# EAGLE design TargetBoard-ResistiveDivider1 (EAGLE 7.3.0)
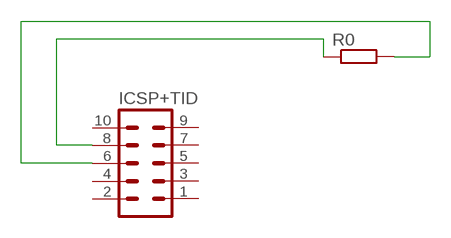
[diagram p0: schematic, sheet 1]

## Parts
ICSP+TID  MA05-2  [MA05-2]
R0  R-EU_R1206  [R1206]

## Nets
N$1: ICSP+TID.6 R0.2
N$2: ICSP+TID.8 R0.1
Unconnected: ICSP+TID.1 ICSP+TID.2 ICSP+TID.3 ICSP+TID.4 ICSP+TID.5 ICSP+TID.7 ICSP+TID.9 ICSP+TID.10

## Library data of the parts
ICSP+TID = con-lstb:MA05-2: PIN HEADER; OC_FARNELL: unknown; OC_NEWARK: unknown
R0 = resistor:R-EU_: RESISTOR, European symbol

## Board
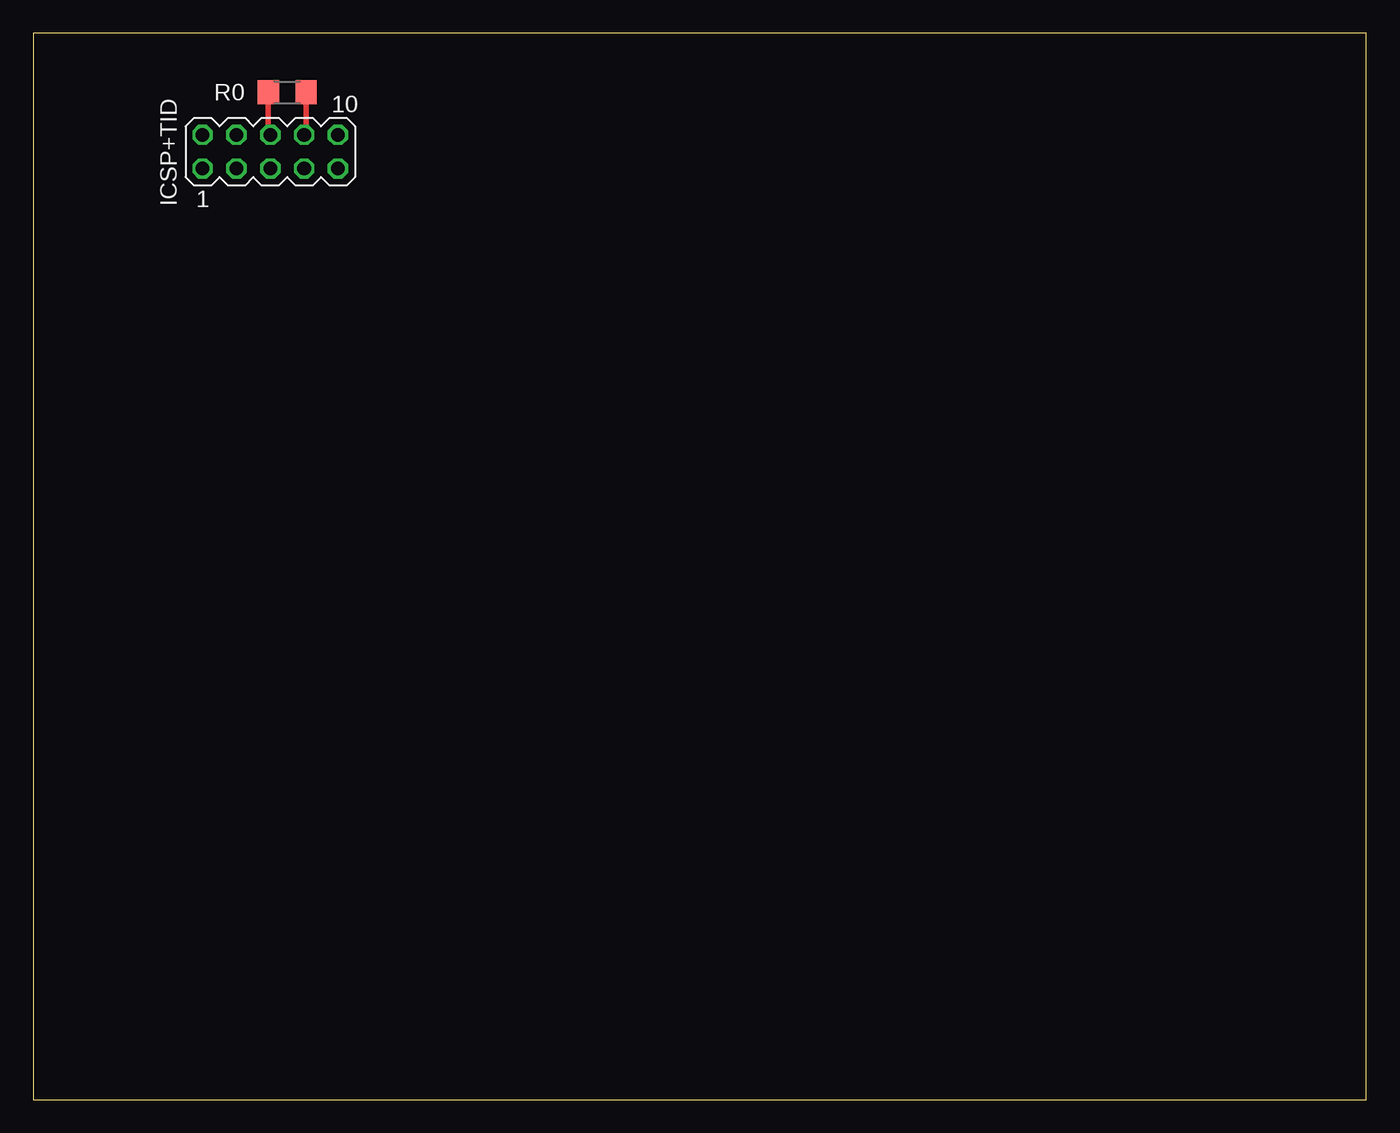
[diagram p1: board, top side]

Size 100 x 80 mm. Coordinates in mm from the lower left corner, seen from the top.
Outline: 0,0 100,0 100,80 0,80 0,0
Copper layers (1*16): Top 0.035mm / dielectric 1.5mm / Bottom 0.035mm
Design rules "default": minimum track width 10mil, minimum drill 24mil, track to track 8mil, track to pad 8mil, pad to pad 8mil, via to via 8mil, smd to smd 8mil, copper to edge 40mil, drill to drill 8mil, minimum pad ring 10mil, minimum via ring 8mil, stop-mask expansion 4mil, vias tented up to drill 0mil, thermal gap 10mil

### Footprints (pad centres in the part's own frame; a part is rotated, then mirrored left to right if it is on the bottom)
MA05-2 = drill 1.016 octagon: 1 -5.08,-1.27; 2 -5.08,1.27; 3 -2.54,-1.27; 4 -2.54,1.27; 5 0,-1.27; 6 0,1.27; 7 2.54,-1.27; 8 2.54,1.27; 9 5.08,-1.27; 10 5.08,1.27
R1206 = smd 1.6 x 1.803: 1 -1.422,0; 2 1.422,0

### Placement (x,y rotation side)
ICSP+TID  17.78,71.12 0 top
R0  19.05,75.56 180 top

### Tracks (layer width: path | path; a pad name or v marks a point on that pad's centre or on a via)
N$1
  Top 0.406: ICSP+TID.6 17.63,72.54 R0.2
N$2
  Top 0.406: ICSP+TID.8 20.47,72.54 R0.1